# Altium schematic sheet ESP32_DevBoard_B.SchDoc
size A4
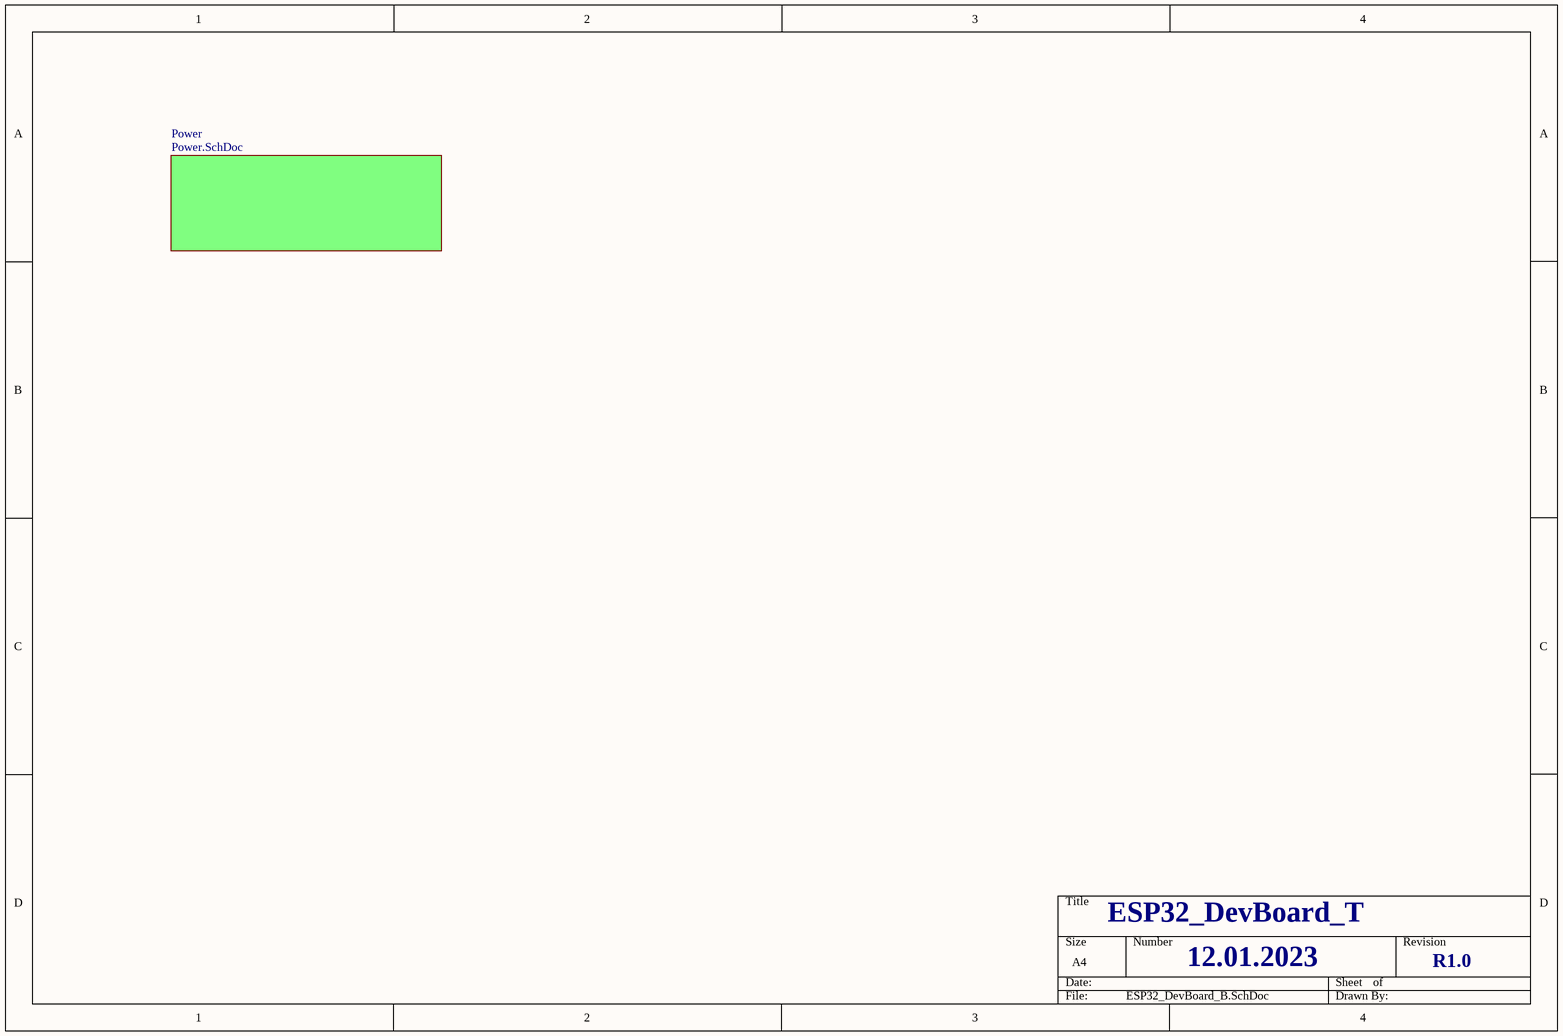
[diagram p0: ESP32_DevBoard_B.SchDoc]

## Sub-sheets
Power = Power.SchDoc: no entries

## Notes on the sheet
- ESP32_DevBoard_T
- 12.01.2023
- R1.0